# EAGLE design bicyclelab-charger-4.1 (EAGLE 6.2)
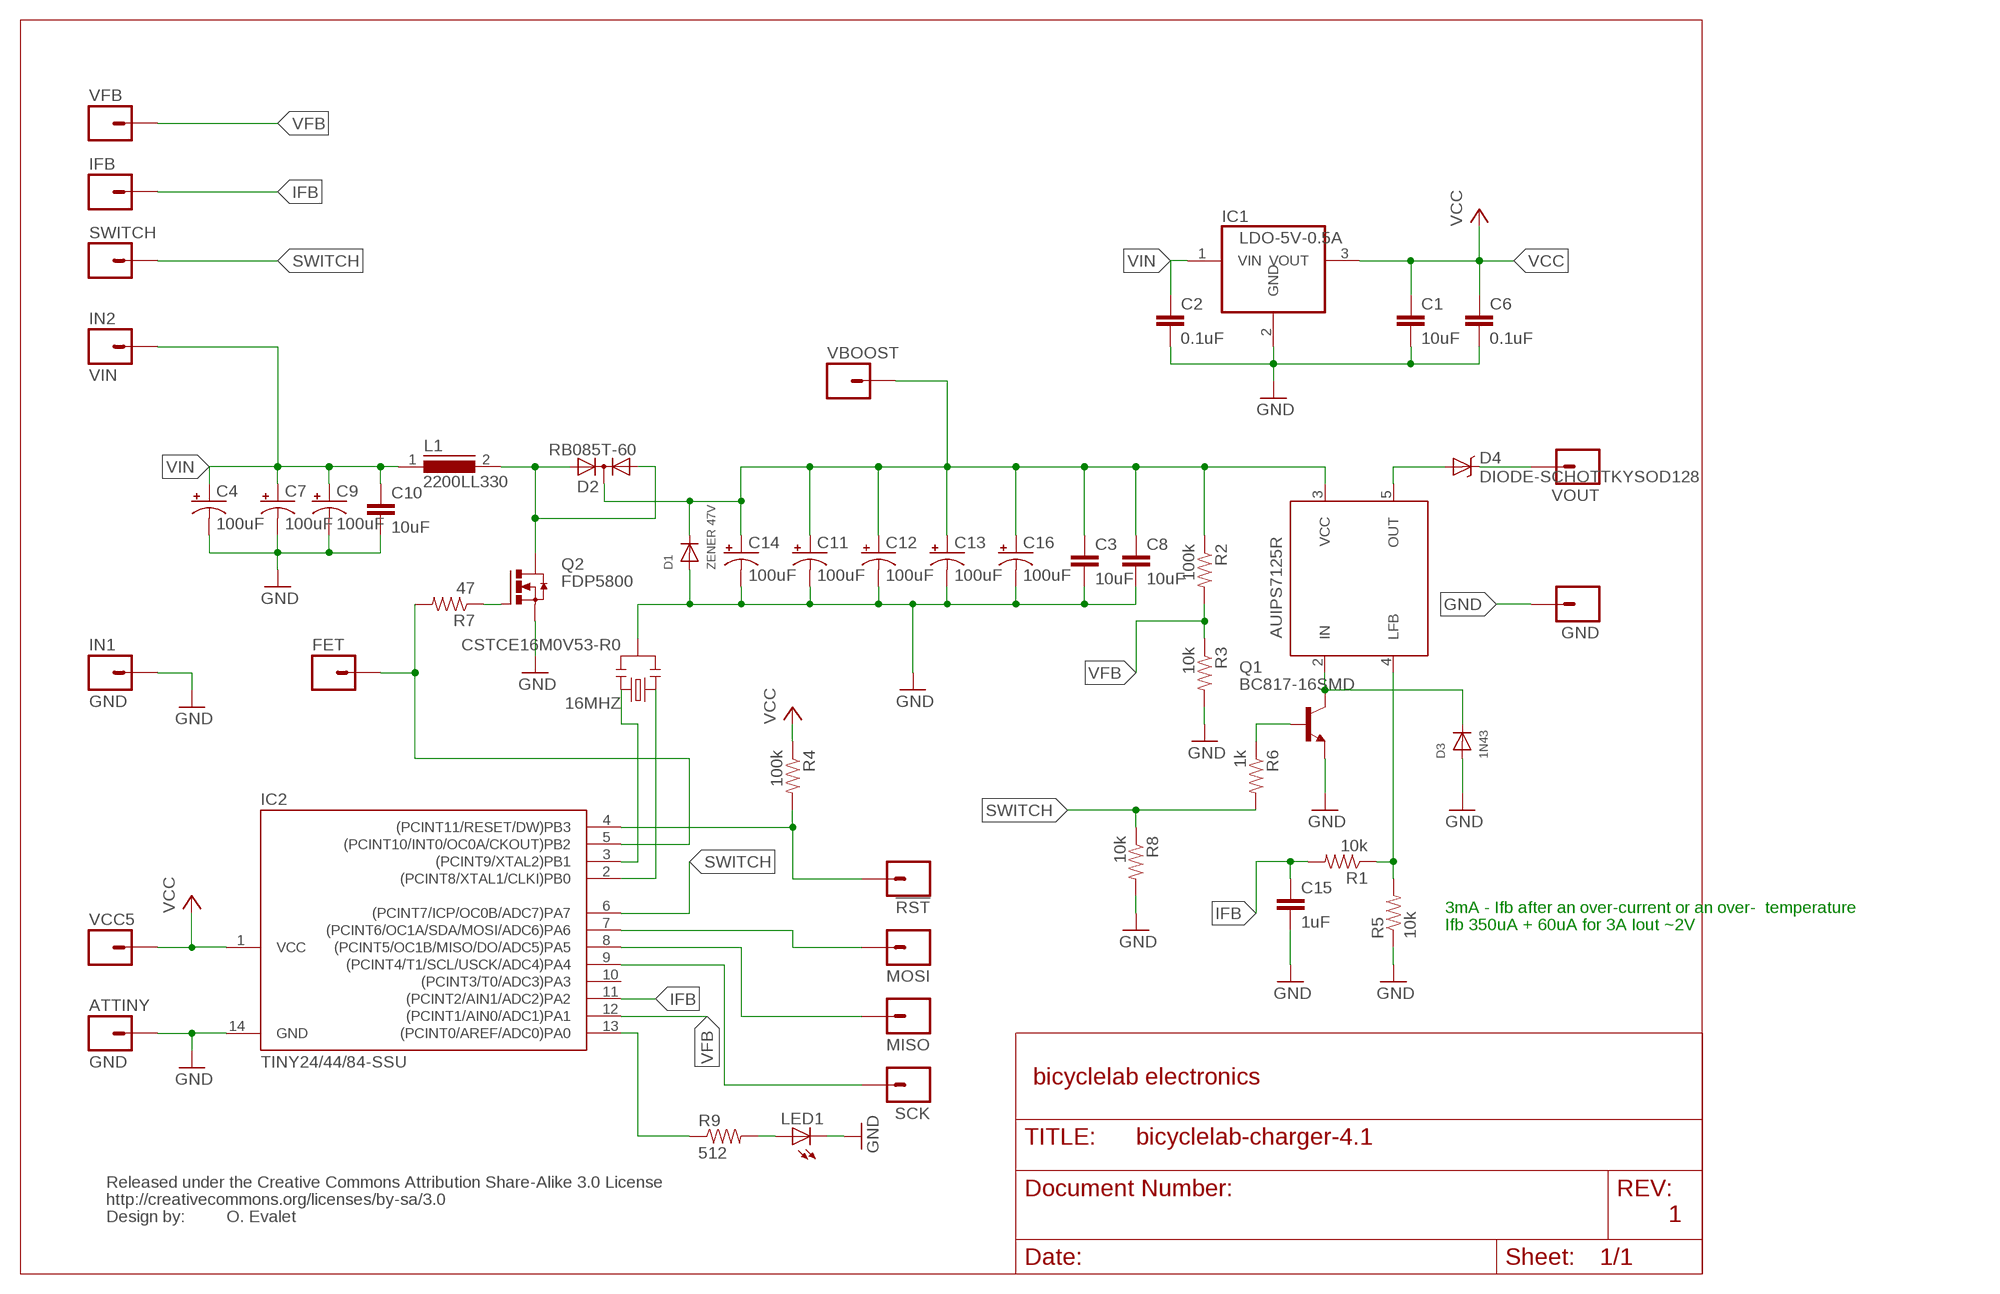
[diagram p0: schematic, sheet 1]

## Parts
16MHZ  CSTCE16M0V53-R0  RESONATORSMD  [RESONATOR-SMD]
!RST  M01SMDNS  [1X01NS]
ATTINY  GND  M01SMDNS  [1X01NS]
C1  10uF  CAP0805  [0805]
C2  0.1uF  CAP0805  [0805]
C3  10uF  CAP1210  [1210]
C4  100uF  CPOL-USD  [PANASONIC_D]
C6  0.1uF  CAP0805  [0805]
C7  100uF  CPOL-USD  [PANASONIC_D]
C8  10uF  CAP1210  [1210]
C9  100uF  CPOL-USD  [PANASONIC_D]
C10  10uF  CAP1210  [1210]
C11  100uF  CPOL-USD  [PANASONIC_D]
C12  100uF  CPOL-USD  [PANASONIC_D]
C13  100uF  CPOL-USD  [PANASONIC_D]
C14  100uF  CPOL-USD  [PANASONIC_D]
C15  1uF  CAP0805  [0805]
C16  100uF  CPOL-USD  [PANASONIC_D]
D1  ZENER 47V  DIODESOD-123  [SOD-123]
D2  RB085T-60  DIODE-2AC|CATO220H  [TO220AB]
D3  1N43  DIODESOD-123  [SOD-123]
D4  DIODE-SCHOTTKYSOD128  [SOD-128]
FET  M01SMDNS  [1X01NS]
GND  M01SMDNS  [1X01NS]
IC1  LDO-5V-0.5A  [SOT223]
IC2  TINY24/44/84-SSU  [SOIC14]
IFB  M01SMDNS  [1X01NS]
IN1  GND  M01SMDNS  [1X01NS]
IN2  VIN  M01PTH  [1X01]
L1  2200LL330  DR175  [DR175]
LED1  LEDCHIP-LED0805  [CHIP-LED0805]
MISO  M01SMDNS  [1X01NS]
MOSI  M01SMDNS  [1X01NS]
Q1  BC817-16SMD  [SOT23-BEC]
Q2  FDP5800  IRF3704  [TO220AH]
R1  10k  RESISTOR  [0805]
R2  100k  RESISTOR  [0805]
R3  10k  RESISTOR  [0805]
R4  100k  RESISTOR  [0805]
R5  10k  RESISTOR  [0805]
R6  1k  RESISTOR  [0805]
R7  47  RESISTOR  [0805]
R8  10k  RESISTOR  [0805]
R9  512  RESISTOR  [0805]
SCK  M01SMDNS  [1X01NS]
SWITCH  M01SMDNS  [1X01NS]
U$5  CREATIVE_COMMONS  [CREATIVE_COMMONS]
U$8  AUIPS7125R  [DPAK-5]
VBOOST  M01SMDNS  [1X01NS]
VCC5  M01PTH  [1X01]
VFB  M01SMDNS  [1X01NS]
VOUT  M01PTH  [1X01]

## Nets
GND: 16MHZ.2 ATTINY.1 C1.2 C2.2 C3.2 C4.- C6.2 C7.- C8.2 C9.- C10.2 C11.- C12.- C13.- C14.- C15.2 C16.- D1.A D3.A GND.1 IC1.2(GND) IC2.14(GND) IN1.1 LED1.C Q1.E Q2.E(S) R3.2 R5.1 R8.2
IFB: C15.1 IC2.11((PCINT2/AIN1/ADC2)PA2) IFB.1 R1.2
N$1: FET.1 IC2.5((PCINT10/INT0/OC0A/CKOUT)PB2) R7.2
N$2: Q1.B R6.1
N$3: !RST.1 IC2.4((PCINT11/RESET/DW)PB3) R4.2
N$4: Q2.B(G) R7.1
N$5: IC2.7((PCINT6/OC1A/SDA/MOSI/ADC6)PA6) MOSI.1
N$6: IC2.8((PCINT5/OC1B/MISO/DO/ADC5)PA5) MISO.1
N$7: IC2.9((PCINT4/T1/SCL/USCK/ADC4)PA4) SCK.1
N$8: D4.1(C) VOUT.1
N$9: R1.1 R5.2 U$8.4(LFB)
N$10: D3.C Q1.C U$8.2(IN)
N$11: LED1.A R9.2
N$12: IC2.13((PCINT0/AREF/ADC0)PA0) R9.1
N$14: 16MHZ.3 IC2.3((PCINT9/XTAL2)PB1)
N$15: 16MHZ.1 IC2.2((PCINT8/XTAL1/CLKI)PB0)
SWITCH: IC2.6((PCINT7/ICP/OC0B/ADC7)PA7) R6.2 R8.1 SWITCH.1
VBOOST: C3.1 C8.1 C11.+ C12.+ C13.+ C14.+ C16.+ D1.C D2.C R2.1 U$8.3(VCC) VBOOST.1
VCC: C1.1 C6.1 IC1.3(VOUT) IC2.1(VCC) R4.1 VCC5.1
VFB: IC2.12((PCINT1/AIN0/ADC1)PA1) R2.2 R3.1 VFB.1
VFET: D2.A1 D2.A2 L1.2 Q2.C(D)
VIN: C2.1 C4.+ C7.+ C9.+ C10.1 IC1.1(VIN) IN2.1 L1.1
VOUT: D4.2(A) U$8.5(OUT)
Unconnected: IC2.10((PCINT3/T0/ADC3)PA3) U$8.1(NC)

## Notes on the sheet
- 3mA - Ifb after an over-current or an over-  temperature
- Ifb 350uA + 60uA for 3A Iout ~2V
- bicyclelab electronics
- O. Evalet | 1

## Library data of the parts
16MHZ = 0-SparkFun:RESONATOR: Resonator Small SMD resonator. This is the itty bitty 10/20MHz resonators with built in caps. CSTCE10M0G55 and CSTCE20M0V53. Footprint has been reviewed closely but hasn't been tested yet.
!RST ATTINY FET GND IFB IN1 IN2 MISO MOSI SCK SWITCH VBOOST VCC5 VFB VOUT = SparkFun:M01: Header 1 Standard 1-pin 0.1" header. Use with straight break away headers (SKU : PRT-00116), right angle break away headers (PRT-00553), swiss pins (PRT-00743), machine pins (PRT-00117), and female headers (PRT-00115).
C1 C3 C8 C10 = bicyclelab:CAP: Capacitor Standard 0603 ceramic capacitor, and 0.1" leaded capacitor.
C2 C6 C15 = SparkFun:CAP: Capacitor Standard 0603 ceramic capacitor, and 0.1" leaded capacitor.
C4 C7 C9 C11-C14 C16 = adafruit:CPOL-US: POLARIZED CAPACITOR, American symbol
D1 D3 = adafruit:DIODE: Diode SMADIODE - SMA Surface Mount Package 20V 1A Schottky Diode Digikey: 641-1014-6-ND DO-1N4148 - Through Hole Small Current Diode SOD-123 20V 1 A (.5mV Vf) Schottky Diode - Digikey: MBRX120TPMSCT-ND SOD-323 10V 570mA (.38mV Vf, 3ns) Schottky Diode - Digikey: ZLLS410CT-ND SOD-523 30V 30mA Schottky Diode (RB751S-40TE61) - Digikey: RB751S-40TE61CT-ND SOT23-R/W - SOT23 Package (R = Solder Paste/Reflow Ovens, W = Hand-Soldering) BAT54Film 40V 300mA - Digikey: 497-7162-1-ND
D2 = diode:DIODE-2AC|CA: Dual DIODE Anode-Cathode|Cathode-Anode
D4 = bicyclelab:DIODE-SCHOTTKY: ZLLS410 10V LOW LEAKAGE SCHOTTKY DIODE IN SOD323
IC1 = bicyclelab:LDO-5V-0.5A: 500mA Low Dropout (LDO) Positive Regulator 3.3V, 5V; MODEL1: uA78M00; MODEL2: SPX2945M3
IC2 = 0-avr-7:TINY24/44/84
L1 = bicyclelab:DR175: High Power Density, High Efficiency, Shielded Inductors Vishay 22uH 22mOhms 11A - 17.5x17.5mm - IHLP6767GZER220M5A
LED1 = adafruit:LED: LED OSRAM: - CHIPLED LG R971, LG N971, LY N971, LG Q971, LY Q971, LO R971, LY R971 LH N974, LH R974 LS Q976, LO Q976, LY Q976 LO Q996 - Hyper CHIPLED LW Q18S LB Q993, LB Q99A, LB R99A - SideLED LS A670, LO A670, LY A670, LG A670, LP A670 LB A673, LV A673, LT A673, LW A673 LH A674 LY A675 LS A676, LA A676, LO A676, LY A676, LW A676 LS A679, LY A679, LG A679 - Hyper Micro SIDELED® LS Y876, LA Y876, LO Y876, LY Y876 LT Y87S - SmartLED LW L88C, LW L88S LB L89C, LB L89S, LG L890 LS L89K, LO L89K, LY L89K LS L896, LA L896, LO L896, LY L896 - TOPLED LS T670, LO T670, LY T670, LG T670, LP T670 LSG T670, LSP T670, LSY T670, LOP T670, LYG T670 LG T671, LOG T671, LSG T671 LB T673, LV T673, LT T673, LW T673 LH T674 LS T676, LA T676, LO T676, LY T676, LB T676, LH T676, LSB T676, LW T676 LB T67C, LV T67C, LT T67C, LS T67K, LO T67K, LY T67K, LW E67C LS E67B, LA E67B, LO E67B, LY E67B, LB E67C, LV E67C, LT E67C LW T67C LS T679, LY T679, LG T679 LS T770, LO T770, LY T770, LG T770, LP T770 LB T773, LV T773, LT T773, LW T773 LH T774 LS E675, LA E675, LY E675, LS T675 LS T776, LA T776, LO T776, LY T776, LB T776 LHGB T686 LT T68C, LB T68C - Hyper Mini TOPLED® LB M676 - Mini TOPLED Santana® LG M470 LS M47K, LO M47K, LY M47K Source: http://www.osram.convergy.de/
Q1 = transistor-npn:BC817*: NPN Transistor
Q2 = transistor-power:IRF3704: SMPS MOSFET HEXFET® Power MOSFET Source: http://www.irf.com/product-info/datasheets/data/irf3704.pdf
R1-R9 = SparkFun:RESISTOR: Resistor Basic schematic elements and footprints for 0603, 1206, and PTH 1/10th watt (small) resistors.
U$5 = SparkFun:CREATIVE_COMMONS
U$8 = bicyclelab:AUIPS7125R

## Net classes
0 default: width 0.203 mm
1 power: width 0.508 mm

## Board
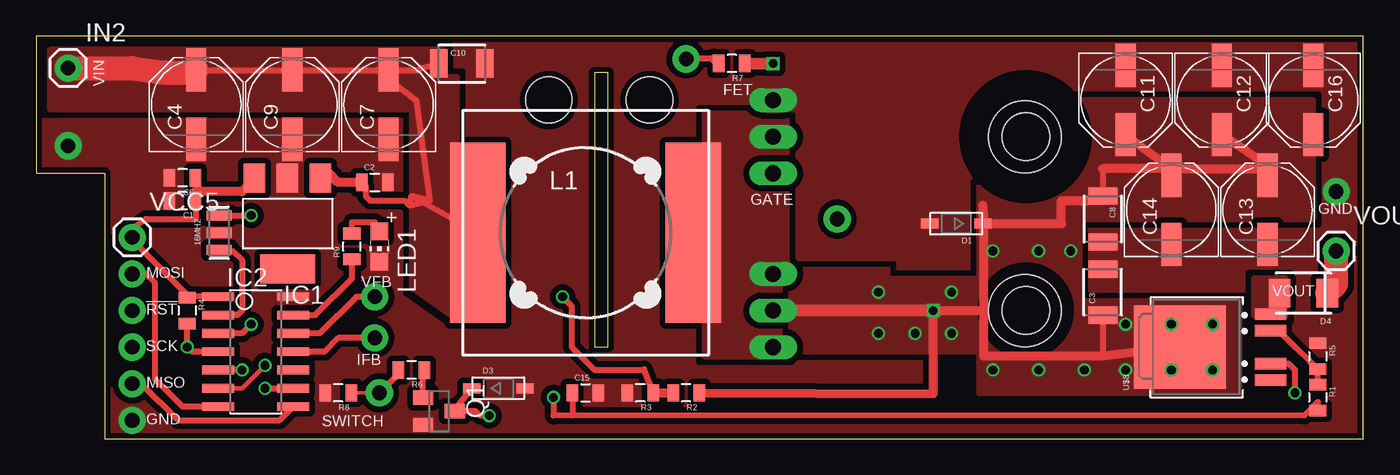
[diagram p1: board, top side]
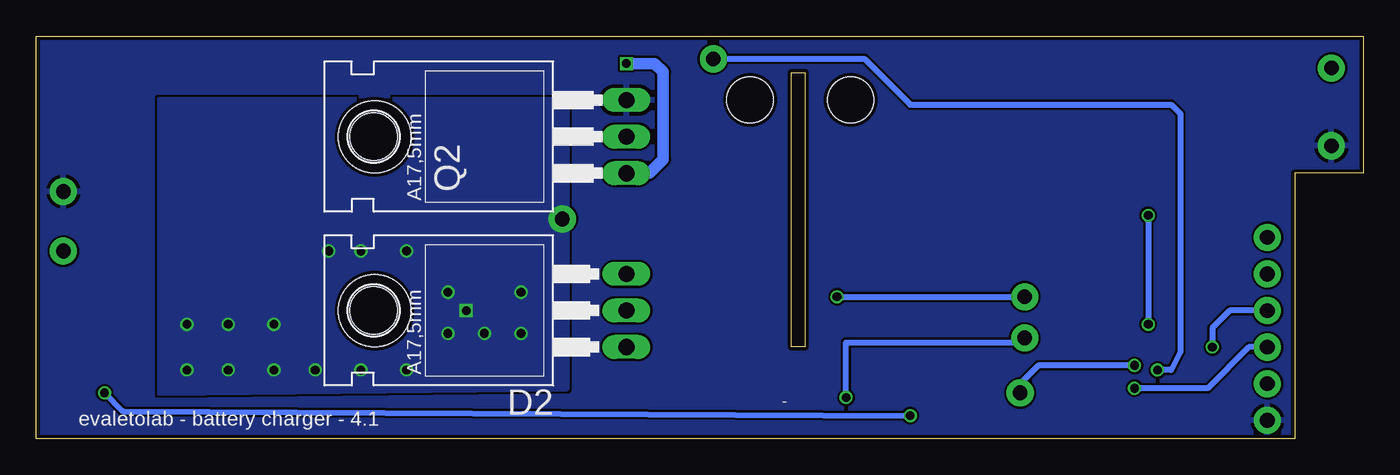
[diagram p2: board, bottom side, seen from below]

Size 92.06 x 27.94 mm. Coordinates in mm from the lower left corner, seen from the top.
Outline: 5.08,27.93 92.06,27.93 92.06,0 4.76,0 4.76,18.42 0,18.42 0,27.94 5.08,27.94
Outline: 39.69,6.35 39.69,25.4 38.73,25.4 38.73,6.35 39.69,6.35
Copper layers (1*16): Top 0.035mm / dielectric 1.5mm / Bottom 0.035mm
Design rules: minimum track width 6mil, minimum drill 12mil, track to track 6mil, track to pad 6mil, pad to pad 6mil, via to via 6mil, smd to smd 0mil, copper to edge 10mil, drill to drill 10mil, minimum pad ring 10mil, minimum via ring 6mil, stop-mask expansion 2mil, vias tented up to drill 100mil, thermal gap 10mil
Holes 3.2 mm at 35.56,23.49 42.55,23.49
Holes 5 mm at 68.58,20.95 68.58,8.89

### Footprints (pad centres in the part's own frame; a part is rotated, then mirrored left to right if it is on the bottom)
RESONATOR-SMD = smd 0.7 x 1.7: 1 -1.2,0; 2 0,0; 3 1.2,0
1X01NS = drill 1.016 pad 1.88: 1 0,0
0805 = smd 0.8 x 1.2: 1 -0.9,0; 2 0.9,0
1210 = smd 1.2 x 2: 1 -1.6,0; 2 1.6,0
PANASONIC_D = smd 3 x 1.4: + 2.4,0; - -2.4,0
SOD-123 = smd 1.2 x 0.7: A 1.85,0; C -1.85,0
TO220AB = drill 1.118 long: A1 -2.54,-6.35; A2 2.54,-6.35; C 0,-6.35 | hole 3.302: 0,11.176
SOD-128 = smd 1.5 x 2: 1 -0.65,-0.25; 2 2.65,-0.25
SOT223 = smd 1.499 x 2.007: 1 -2.261,-3.15; 2 0.025,-3.15; 3 2.311,-3.15 | smd 3.81 x 2.007: 4 0,3.15
SOIC14 = smd 0.61 x 2.21: 1 -3.81,-2.603; 2 -2.54,-2.603; 3 -1.27,-2.603; 4 0,-2.603; 5 1.27,-2.603; 6 2.54,-2.603; 7 3.81,-2.603; 8 3.81,2.603; 9 2.54,2.603; 10 1.27,2.603; 11 0,2.603; 12 -1.27,2.603; 13 -2.54,2.603; 14 -3.81,2.603
1X01 = drill 1.016 pad 1.88: 1 0,0
DR175 = smd 3.85 x 12.5: 1 -7.475,0; 2 7.475,0
CHIP-LED0805 = smd 1.2 x 1.2: A 0,-1.05; C 0,1.05
SOT23-BEC = smd 1 x 1.4: B -0.95,-1.1; C 0,1.1; E 0.95,-1.1
TO220AH = drill 1.118 long: B -2.54,-6.35; C 0,-6.35; E 2.54,-6.35 | hole 3.302: 0,11.176
DPAK-5 = smd 0.8 x 2.2: 1 -2.28,-5.3; 2 -1.14,-5.3; 4 1.14,-5.3; 5 2.28,-5.3 | smd 5.8 x 6.4: 3 0,1

### Placement (x,y rotation side)
16MHZ  12.7,14.29 90 top
!RST  6.67,8.89 0 top
ATTINY  6.67,1.27 0 top
C1  10.16,16.51 180 top
C2  23.49,17.78 0 top
C3  73.98,10.16 90 top
C4  11.11,23.18 90 top
C6  10.16,18.1 180 top
C7  24.45,23.18 90 top
C8  73.98,15.24 270 top
C9  17.78,23.18 90 top
C10  29.53,26.04 0 top
C11  75.56,23.49 270 top
C12  82.23,23.49 270 top
C13  85.41,15.88 90 top
C14  78.74,15.88 90 top
C15  38.1,3.17 0 top
C16  88.58,23.49 270 top
D1  63.82,14.92 180 top
D2  57.47,8.89 90 bottom
D3  32.07,3.49 0 top
D4  88.9,9.84 180 top
FET  45.09,26.35 0 top
GND  90.17,17.14 180 top
IC1  17.46,14.92 180 top
IC2  15.24,6.03 270 top
IFB  23.49,6.99 0 top
IN1  2.22,20.32 0 top
IN2  2.22,25.72 0 top
L1  38.1,14.29 0 top
LED1  23.81,13.34 180 top
MISO  6.67,3.81 0 top
MOSI  6.67,11.43 0 top
Q1  27.94,1.9 270 top
Q2  57.47,20.95 90 bottom
R1  88.9,2.86 270 top
R2  45.09,3.17 180 top
R3  41.91,3.17 180 top
R4  10.48,8.89 270 top
R5  88.9,5.71 270 top
R6  26.04,4.76 180 top
R7  48.26,26.04 180 top
R8  20.95,3.17 180 top
R9  21.91,13.34 90 top
SCK  6.67,6.35 0 top
SWITCH  23.81,3.17 0 top
U$5  27.3,-12.06 0 top  (outside the outline)
U$8  80.33,6.35 90 top
VBOOST  55.56,15.24 0 top
VCC5  6.67,13.97 0 top
VFB  23.49,9.84 0 top
VOUT  90.17,13.02 0 top

### Tracks (layer width: path | path; a pad name or v marks a point on that pad's centre or on a via)
GND
  pour Top (isolate 0.406, rank 4, no thermals): 0.32,27.94 92.07,27.94 92.07,0 0.32,0
  pour Bottom (rank 3): 0.32,0.32 91.76,0 91.76,27.62 0.32,27.94
IFB  (via drill 0.6)
  Top 0.406: R1.2 88.9,2.54 87.95,1.59 37.15,1.61 | 37.15,1.61 35.88,1.59 v35.88,2.86 | IFB.1 20.95,6.99 20,6.03 IC2.11 | C15.1 37.2,1.65 37.15,1.61
  Bottom 0.406: v35.88,2.86 35.88,6.67 24.13,6.67 IFB.1
N$1  (via drill 0.6)
  Top 0.406: 46.99,26.35 FET.1 | v14.29,4.76 IC2.5
  Top 0.61: 46.99,26.35 R7.2
  Bottom 0.406: FET.1 34.61,26.35 31.43,23.18 13.34,23.18 12.7,22.54 12.7,6.03 13.34,4.76 v14.29,4.76
N$2
  Top 0.406: Q1.B 26.84,4.67 R6.1
N$3  (via drill 0.6)
  Top 0.406: R4.2 v10.48,6.35 10.79,6.03 IC2.4
  Bottom 0.406: !RST.1 9.26,8.89 10.48,7.67 v10.48,6.35
N$4  (via drill 0.6)
  Top 0.813: v51.12,26.04 R7.1
  Bottom 0.813: Q2.B 49.53,18.42 48.58,19.37 48.58,25.45 R7.1 v51.12,26.04
N$5
  Top 0.406: MOSI.1 7.62,11.43 8.26,10.79 8.26,4.13 10.16,2.22 IC2.7
N$6
  Top 0.406: MISO.1 7.3,3.81 9.84,1.27 16.89,1.27 IC2.8
N$7  (via drill 0.6)
  Top 0.406: v15.87,3.49 IC2.9
  Bottom 0.406: SCK.1 7.94,6.35 10.79,3.49 v15.87,3.49
N$8
  Top 1.676: D4.1 90.17,10.71 VOUT.1
N$9
  Top 0.406: U$8.4 86.26,7.4 87.31,6.35 88.32,5.4 R5.2 R1.1
N$10  (via drill 0.6)
  Top 0.406: v31.43,1.59 30.8,1.59 30.48,1.9 Q1.C 28.95,1.9 D3.C | U$8.2 86.86,5.21 87.31,4.76 v87.31,3.17
  Bottom 0.406: v87.31,3.17 86.04,1.9 v31.43,1.59
N$11
  Top 0.406: R9.2 21.91,15.02 23.49,15.02 LED1.A
N$12
  Top 0.406: IC2.13 19.37,8.57 21.91,11.11 R9.1
N$14  (via drill 0.6)
  Top 0.406: 16MHZ.3 v14.92,15.49 | IC2.3 14.29,7.3 v14.92,7.94
  Bottom 0.406: v14.92,15.49 v14.92,7.94
N$15
  Top 0.406: 16MHZ.1 12.77,13.02 13.65,13.02 14.29,12.38 14.29,8.89 13.97,8.57 IC2.2
SWITCH  (via drill 0.6)
  Top 0.254: R8.1 SWITCH.1
  Top 0.305: IC2.6 14.29,3.49 v15.87,5.08
  Top 0.406: 24.13,2.86 SWITCH.1 25.13,4.5 R6.2
  Bottom 0.406: v15.87,5.08 22.54,5.08 23.81,3.81 SWITCH.1
VBOOST  (via drill 0.6)
  Top 0.406: 73.98,18.73 C8.1 | C3.1 73.98,5.71
  Top 0.61: 65.72,8.89 v62.23,8.89 62.23,3.12 R2.1 | 65.72,8.89 65.72,15.56 65.67,15.56 D1.C | 78.74,18.73 85.72,18.73 | 85.72,18.73 C13.+ | C12.+ 85.72,18.73 | C11.+ 78.74,18.73 | C14.+ 78.74,18.73 | U$8.3 73.98,5.71 65.72,5.71 65.72,8.89 | 78.74,18.73 73.98,18.73 | 65.67,16.19 D1.C | D1.C 71.12,14.92 71.12,16.51 73.98,16.51 C8.1
  Top 0.813: v62.23,8.89 D2.C
  other vias: 81.6,4.76 81.6,7.94 78.74,7.94 78.74,4.76 75.56,4.76 75.56,7.94 69.53,13.02 72.71,4.76 69.53,4.76 66.36,4.76 60.96,7.3 63.5,10.16 63.5,7.3 58.42,10.16 66.36,13.02 71.75,13.02 58.42,7.3
  pour Top (isolate 0.406, no thermals): 88.58,15.24 88.58,23.49 65.41,23.49 65.41,3.17 83.5,3.17 83.5,9.53 72.39,9.53 72.39,15.24
  pour Top (isolate 0.406, no thermals): 65.41,6.03 52.39,6.03 52.39,11.75 59.05,11.75 59.05,11.43 58.74,11.43 58.74,11.11 65.41,11.11
  pour Bottom (rank 2, no thermals): 83.5,3.17 55.25,3.49 55.25,23.49 83.5,23.49
VCC
  Top 0.406: IC2.1 12.6,9.88 10.57,9.88 | 10.57,9.88 R4.1 | C1.1 11.1,15.24 7.62,15.24 6.67,14.6 VCC5.1 6.67,13.78 10.57,9.88
  Top 0.61: 11.22,17.15 14.29,17.15 14.92,17.84 IC1.3 | 11.22,17.15 C6.1 | 11.22,17.15 C1.1
VFB  (via drill 0.6)
  Top 0.406: VFB.1 22.22,9.84 19.68,7.3 IC2.12 | R3.1 42.18,4.81 42.12,4.76 38.73,4.76 37.15,6.35 37.15,9.21 v36.51,9.84
  Top 0.61: R3.1 R2.2
  Bottom 0.406: v36.51,9.84 VFB.1
VFET
  pour Top (isolate 0.406, rank 2, no thermals): 46.36,5.71 52.07,5.71 52.07,22.54 46.36,22.54
VIN
  Top 0.406: C4.+ C7.+ | C7.+ 26.53,25.58 26.67,25.72 C10.1 | C7.+ 23.63,25.58 26.35,23.49 27.31,16.51 | 27.31,16.51 26.04,16.83 L1.1 | 25.98,16.77 25.89,16.19 | 25.89,16.19 27.31,16.51 | C2.1 22.86,17.52 22.86,16.83 23.18,16.51 25.57,16.51 25.89,16.19
  Top 0.61: C2.1 20.95,17.78 20.32,18.42 20.07,18.42 IC1.1
  Top 1.676: IN2.1 6.67,25.72 8.89,25.4 10.3,25.4 C4.+
  pour Top (isolate 0.305, rank 2, no thermals): 29.21,8.26 29.21,25.08 28.26,25.08 28.26,26.99 0.95,26.99 0.95,22.86 26.04,22.86 26.04,10.48
VOUT
  pour Top (rank 2, no thermals): 84.45,8.57 86.68,8.57 86.68,11.11 84.45,11.11

### Text on the board
tPlace: VIN | FET | GATE | GND | MOSI | VFB | VOUT | !RST | SCK | IFB | MISO | GND | SWITCH
bPlace: - | evaletolab - battery charger - 4.1
tValues: 100W BATTERY CHARGER - SOURCE 20V 5A - EFF. 90% | O.Evalet - Version 0.1